# EAGLE design esptoy_v123 (EAGLE 7.2.0)
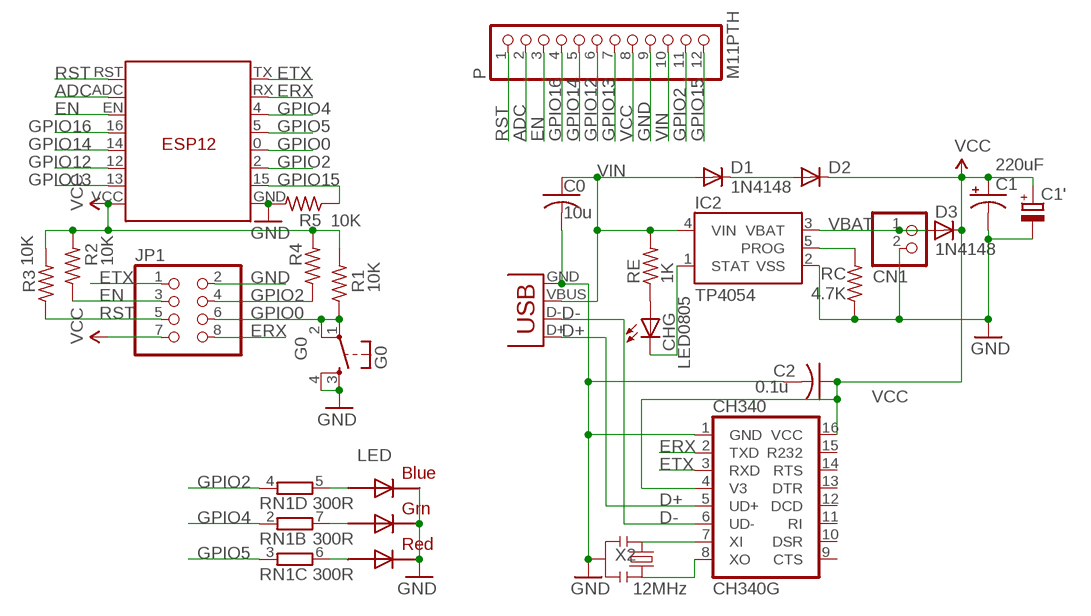
[diagram p0: schematic, sheet 1]

## Parts
C0  10u  C-USC0805K  [C0805K]
C1  220uF  CAP_POL3528-KIT  [EIA3528-KIT]
C1'  CPOL-EUD  [PANASONIC_D]
C2  0.1u  C-USC0603K  [C0603K]
CH340  CH340G  [SO16]
CHG  LED0805  LEDCHIPLED_0805  [CHIPLED_0805]
CN1  JST_2PIN-SMT-RA  [JST-PH-2-SMT-RA]
D1  1N4148  DIODE-MINIMELF  [MINIMELF]
D2  DIODE-MINIMELF  [MINIMELF]
D3  1N4148  DIODE-MINIMELF  [MINIMELF]
G0  G0  TAC_SWITCHSMD  [TACTILE_SWITCH_SMD]
IC2  TP4054  MCP73831  [SOT23-5]
JP1  PINHD-2X4  [2X04]
LED  RGBLED5050  [RGBLED5050]
P  M11PTH  PINHD-1X12-CB  [1X12-CB]
R1  10K  R-US_R0603  [R0603]
R2  10K  R-US_R0603  [R0603]
R3  10K  R-US_R0603  [R0603]
R4  R-US_R0603  [R0603]
R5  10K  R-US_R0603  [R0603]
RC  4.7K  R-US_R0805  [R0805]
RE  1K  R-US_R0603  [R0603]
RN1  300R  4R-NEXB38V  [EXB38V]
U$1  ESP12  [ESP12]
X2  12MHz  RESONATORSMD  [RESONATOR-SMD]
X3  USB-MICROB  [USB-MICROB]

## Nets
ADC: P.2 U$1.ADC
D+: CH340.5(UD+) X3.D+
D-: CH340.6(UD-) X3.D-
EN: JP1.3 P.3 R2.1 U$1.EN
ERX: CH340.2(TXD) JP1.8 U$1.RX
ETX: CH340.3(RXD) JP1.1 U$1.TX
GND: C0.2 C1'.- C1.C(-) C2.2 CH340.1(GND) CN1.2 G0.3 G0.4 IC2.2(VSS) JP1.2 LED.4(BLUE_C) LED.5(RED_C) LED.6(GREEN_C) P.9 R5.2 RC.1 U$1.GND X2.2 X3.GND
GPIO0: G0.1 G0.2 JP1.6 R1.1 U$1.0(G0)
GPIO2: JP1.4 P.11 R4.1 RN1.4 U$1.2(G2)
GPIO4: RN1.2 U$1.4(G4)
GPIO5: RN1.3 U$1.5(G5)
GPIO12: P.6 U$1.12(G12)
GPIO13: P.7 U$1.13(G13)
GPIO14: P.5 U$1.14(G14)
GPIO15: P.12 R5.1 U$1.15(G15)
GPIO16: P.4 U$1.16(G16)
N$1: D1.C D2.A
N$2: LED.3(BLUE_A) RN1.5
N$3: IC2.5(PROG) RC.2
N$4: CHG.A RE.1
N$5: CHG.C IC2.1(STAT)
N$6: LED.1(GREEN_A) RN1.7
N$7: LED.2(RED_A) RN1.6
N$11: CH340.7(XI) X2.1
N$13: CH340.8(XO) X2.3
RST: JP1.5 P.1 R3.1 U$1.RST
VBAT [power]: CN1.1 D3.A IC2.3(VBAT)
VCC [power]: C1'.+ C1.A(+) C2.1 CH340.4(V3) CH340.16(VCC) D2.C D3.C JP1.7 P.8 R1.2 R2.2 R3.2 R4.2 U$1.VCC
VIN [power]: C0.1 D1.A IC2.4(VIN) P.10 RE.2 X3.VBUS
Unconnected: CH340.9(CTS) CH340.10(DSR) CH340.11(RI) CH340.12(DCD) CH340.13(DTR) CH340.14(RTS) CH340.15(R232) RN1.1 RN1.8

## Library data of the parts
C0 = adafruit2013:C-US: CAPACITOR, American symbol
C1 = SparkFunNew:CAP_POL: Capacitor Polarized These are standard SMD and PTH capacitors. Normally 10uF, 47uF, and 100uF in electrolytic and tantalum varieties. Always verify the external diameter of the through hole cap, it varies with capacity, voltage, and manufacturer. The EIA devices should be standard.
C1' = rcl:CPOL-EU: POLARIZED CAPACITOR, European symbol
C2 = adafruit:C-US: CAPACITOR, American symbol
CH340 = SparkFunNew:CH340
CHG = led:LED: LED OSRAM: - CHIPLED LG R971, LG N971, LY N971, LG Q971, LY Q971, LO R971, LY R971 LH N974, LH R974 LS Q976, LO Q976, LY Q976 LO Q996 - Hyper CHIPLED LW Q18S LB Q993, LB Q99A, LB R99A - SideLED LS A670, LO A670, LY A670, LG A670, LP A670 LB A673, LV A673, LT A673, LW A673 LH A674 LY A675 LS A676, LA A676, LO A676, LY A676, LW A676 LS A679, LY A679, LG A679 - Hyper Micro SIDELED® LS Y876, LA Y876, LO Y876, LY Y876 LT Y87S - SmartLED LW L88C, LW L88S LB L89C, LB L89S, LG L890 LS L89K, LO L89K, LY L89K LS L896, LA L896, LO L896, LY L896 - TOPLED LS T670, LO T670, LY T670, LG T670, LP T670 LSG T670, LSP T670, LSY T670, LOP T670, LYG T670 LG T671, LOG T671, LSG T671 LB T673, LV T673, LT T673, LW T673 LH T674 LS T676, LA T676, LO T676, LY T676, LB T676, LH T676, LSB T676, LW T676 LB T67C, LV T67C, LT T67C, LS T67K, LO T67K, LY T67K, LW E67C LS E67B, LA E67B, LO E67B, LY E67B, LB E67C, LV E67C, LT E67C LW T67C LS T679, LY T679, LG T679 LS T770, LO T770, LY T770, LG T770, LP T770 LB T773, LV T773, LT T773, LW T773 LH T774 LS E675, LA E675, LY E675, LS T675 LS T776, LA T776, LO T776, LY T776, LB T776 LHGB T686 LT T68C, LB T68C - Hyper Mini TOPLED® LB M676 - Mini TOPLED Santana® LG M470 LS M47K, LO M47K, LY M47K Source: http://www.osram.convergy.de LUXEON: - LUMILED® LXK2-PW12-R00, LXK2-PW12-S00, LXK2-PW14-U00, LXK2-PW14-V00 LXK2-PM12-R00, LXK2-PM12-S00, LXK2-PM14-U00 LXK2-PE12-Q00, LXK2-PE12-R00, LXK2-PE12-S00, LXK2-PE14-T00, LXK2-PE14-U00 LXK2-PB12-K00, LXK2-PB12-L00, LXK2-PB12-M00, LXK2-PB14-N00, LXK2-PB14-P00, LXK2-PB14-Q00 LXK2-PR12-L00, LXK2-PR12-M00, LXK2-PR14-Q00, LXK2-PR14-R00 LXK2-PD12-Q00, LXK2-PD12-R00, LXK2-PD12-S00 LXK2-PH12-R00, LXK2-PH12-S00 LXK2-PL12-P00, LXK2-PL12-Q00, LXK2-PL12-R00 Source: www.luxeon.com KINGBRIGHT: KA-3528ASYC Source: www.kingbright.com
CN1 = adafruit:JST_2PIN: JST 2-Pin Connectors of various flavors SMT-RA (S2B-PH-SM4) 4UConnector #17311 SMT (B2B-PH-SM4) THM-RA (S2B-PH) THM (B2B-PH)
D1-D3 = diode:DIODE-: DIODE
G0 = SparkFunNew:TAC_SWITCH: Momentary Switch Button commonly used for reset or general input. Spark Fun Electronics SKU : COM-00097
IC2 = SparkFunNew:MCP73831: Microchip's MCP73831 Miniature single cell, fully integrated Li-Ion, Li-polymer charge management controller http://ww1.microchip.com/downloads/en/DeviceDoc/21984a.pdf
JP1 = pinhead:PINHD-2X4: PIN HEADER
LED = adafruit:RGBLED: For 5050 RGB LEDs, the order of the LEDs may vary from one manufacturer to another!
P = adafruit:PINHD-1X12: PIN HEADER
R1-R5 RE = adafruit (picker 的冲突副本 2014-10-29):R-US_: RESISTOR, American symbol
RC = adafruit2013:R-US_: RESISTOR, American symbol
RN1 = resistor-dil:4R-N: Array Chip Resistor Source: RS Component / Phycomp; OC_FARNELL: unknown; OC_NEWARK: unknown
U$1 = JeeParts:ESP12
X2 = SparkFunNew:RESONATOR: Resonator Small SMD resonator. This is the itty bitty 10/20MHz resonators with built in caps. CSTCE10M0G55 and CSTCE20M0V53. Footprint has been reviewed closely but hasn't been tested yet.
X3 = SparkFunNew:USB: USB Connectors USB-B-PTH is fully proven SKU : PRT-00139 USB-miniB is fully proven SKU : PRT-00587 USB-A-PCB is untested. USB-A-H is throughly reviewed, but untested. Spark Fun Electronics SKU : PRT-00437 USB-B-SMT is throughly reviewed, but untested. Needs silkscreen touching up. USB-A-S has not been used/tested USB-MB-H has not been used/tested

## Net classes
0 default: width 0.178 mm, clearance 0.178 mm
1 power: width 0.254 mm, clearance 0.178 mm

## Board
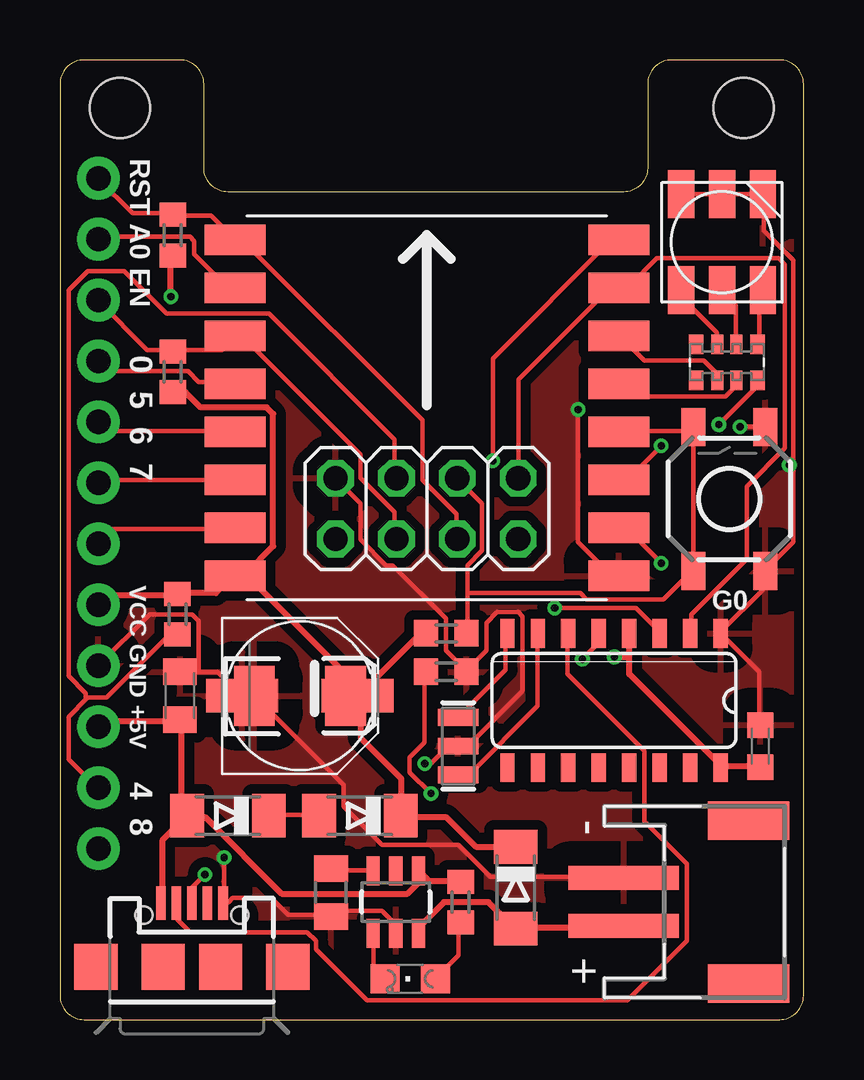
[diagram p1: board, top side]
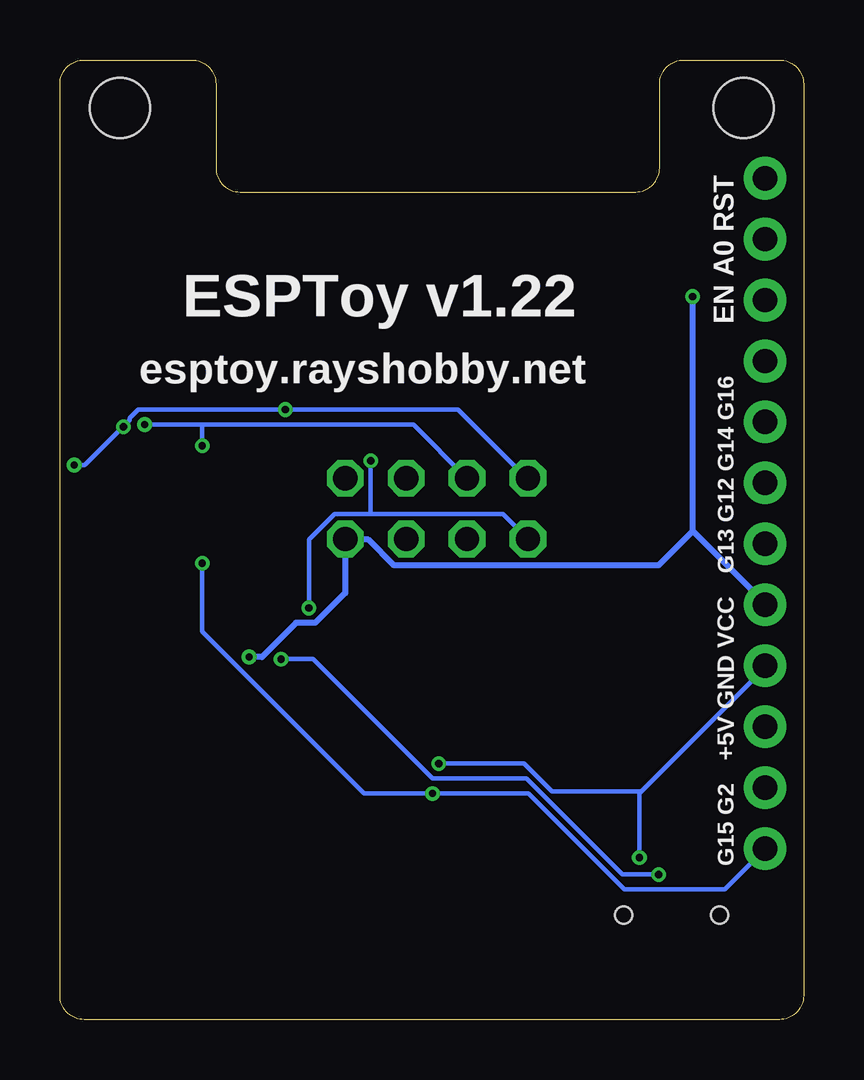
[diagram p2: board, bottom side, seen from below]

Size 31 x 40 mm. Coordinates in mm from the lower left corner, seen from the top.
Outline: 1,0 30,0 arc90 31,1 31,39 arc90 30,40 25.5,40 arc90 24.5,39 24.5,35.5 arc-90 23.5,34.5 7,34.5 arc-90 6,35.5 6,39 arc90 5,40 1,40 arc90 0,39 0,1 arc90 1,0
Copper layers (1*16): Top 0.035mm / dielectric 1.5mm / Bottom 0.035mm
Design rules "Fusion_eagle_rule_v1.1 *": minimum track width 6mil, minimum drill 12mil, track to track 6mil, track to pad 6mil, pad to pad 6mil, via to via 6mil, smd to smd 0mil, copper to edge 10mil, drill to drill 10mil, minimum pad ring 10mil, minimum via ring 6mil, stop-mask expansion 2mil, vias tented up to drill 100mil, thermal gap 40mil
Holes 2.5 mm at 28.5,38 2.5,38
tRestrict: area 26.7,36.2 to 30.3,39.8; area 0.7,36.2 to 4.3,39.8
vRestrict: area 2.9,6.2 to 3.9,35.8

### Footprints (pad centres in the part's own frame; a part is rotated, then mirrored left to right if it is on the bottom)
C0805K = smd 1.1 x 1.4: 1 -1,0; 2 1,0
EIA3528-KIT = smd 1.7 x 2.5: A 1.9,0; C -1.9,0
PANASONIC_D = smd 3 x 1.4: + 2.4,0; - -2.4,0
C0603K = smd 1.05 x 1.08: 1 -0.875,0; 2 0.875,0
SO16 = smd 0.6 x 1.2: 1 -4.445,-2.8; 2 -3.175,-2.8; 3 -1.905,-2.8; 4 -0.635,-2.8; 5 0.635,-2.8; 6 1.905,-2.8; 7 3.175,-2.8; 8 4.445,-2.8; 9 4.445,2.8; 10 3.175,2.8; 11 1.905,2.8; 12 0.635,2.8; 13 -0.635,2.8; 14 -1.905,2.8; 15 -3.175,2.8; 16 -4.445,2.8
CHIPLED_0805 = smd 1.2 x 1.2: A 0,-1.05; C 0,1.05
JST-PH-2-SMT-RA = smd 1 x 4.6: 1 1,-3.7; 2 -1,-3.7 | smd 1.6 x 3.4: NC1 -3.4,1.5; NC2 3.4,1.5
MINIMELF = smd 1.4 x 1.8: A 1.7,0; C -1.7,0
TACTILE_SWITCH_SMD = smd 1.6 x 1: 1 -3,1.5; 2 3,1.5; 3 -3,-1.5; 4 3,-1.5
SOT23-5 = smd 0.55 x 1.2: 1 -0.95,-1.3; 2 0,-1.3; 3 0.95,-1.3; 4 0.95,1.3; 5 -0.95,1.3; 6 0,1.3
2X04 = drill 1.016 octagon: 1 -3.81,-1.27; 2 -3.81,1.27; 3 -1.27,-1.27; 4 -1.27,1.27; 5 1.27,-1.27; 6 1.27,1.27; 7 3.81,-1.27; 8 3.81,1.27
RGBLED5050 = smd 2 x 1.1: 1 -2,1.7; 2 -2,0; 3 -2,-1.7; 4 2,-1.7; 5 2,0; 6 2,1.7
1X12-CB = drill 1.016 pad 1.778: 1 -13.97,0; 2 -11.43,0; 3 -8.89,0; 4 -6.35,0; 5 -3.81,0; 6 -1.27,0; 7 1.27,0; 8 3.81,0; 9 6.35,0; 10 8.89,0; 11 11.43,0; 12 13.97,0
R0603 = smd 1 x 1.1: 1 -0.85,0; 2 0.85,0
R0805 = smd 1.1 x 1.4: 1 -1,0; 2 1,0
EXB38V = smd 0.6 x 0.8: 1 -1.275,-0.75; 4 1.275,-0.75; 5 1.275,0.75; 8 -1.275,0.75 | smd 0.5 x 0.8: 2 -0.4,-0.75; 3 0.4,-0.75; 6 0.4,0.75; 7 -0.4,0.75
ESP12 = smd 2.54 x 1.27: 0 8,-2; 2 8,-4; 4 8,2; 5 8,0; 12 -8,-4; 13 -8,-6; 14 -8,-2; 15 8,-6; 16 -8,0; ADC -8,4; EN -8,2; GND 8,-8; RST -8,6; RX 8,4; TX 8,6; VCC -8,-8
RESONATOR-SMD = smd 0.7 x 1.7: 1 -1.2,0; 2 0,0; 3 1.2,0
USB-MICROB = smd 0.4 x 1.4: D+ 0,2.65; D- -0.65,2.65; GND 1.3,2.65; ID 0.65,2.65; VBUS -1.3,2.65 | smd 1.8 x 1.9: MT1 -4,0; MT2 4,0; MT3 1.2,0; MT4 -1.2,0 | hole 0.7: -2,2.15; 2,2.15

### Placement (x,y rotation side)
C0  5,13.5 90 top
C1  10,13.5 0 top
C1'  10,13.5 0 top
C2  29.2,11.4 90 top
CH340  23.1,13.3 180 top
CHG  14.6,1.7 90 top
CN1  27.2,4.9 270 top
D1  7,8.5 180 top
D2  12.5,8.5 180 top
D3  19,5.5 270 top
G0  27.9,21.7 90 top
IC2  14,4.9 0 top
JP1  15.3,21.3 0 top
LED  27.6,32.4 90 top
P  1.6,21.1 270 top
R1  16.1,16.1 180 top
R2  4.7,27 270 top
R3  4.7,32.7 270 top
R4  4.9,16.9 90 top
R5  16.1,14.5 0 top
RC  11.3,5.3 90 top
RE  16.7,4.9 90 top
RN1  27.8,27.4 0 top
U$1  15.3,26.5 0 top
X2  16.6,11.4 90 top
X3  5.5,2.2 0 top

### Tracks (layer width: path | path; a pad name or v marks a point on that pad's centre or on a via)
ADC
  Top 0.178: U$1.ADC 7.29,30.58 6.93,30.58 5.6,31.91 5.6,32.45 5.42,32.63 1.69,32.63 P.2
D+  (via drill 0.3)
  Top 0.178: v21.78,15.02 22.4,15.65 22.4,16.09 CH340.5 | v6.04,6.04 5.51,5.51 5.51,4.89 X3.D+
  Bottom 0.178: v21.78,15.02 20.45,15.02 15.47,10.05 11.56,10.05 7.56,6.04 v6.04,6.04
D-
  Top 0.178: CH340.6 21.16,16.09 21.16,14.4 24.36,11.2 24.36,8.27 26.14,6.49 26.14,3.29 23.65,0.8 12.8,0.8 10.67,2.93 10.67,3.29 10.31,3.65 5.42,3.65 4.89,4.18 4.89,4.8 X3.D-
EN
  Top 0.178: P.3 1.6,29.96 3.65,27.91 4.62,27.91 R2.1 4.71,27.91 6.76,27.91 7.29,28.45 U$1.EN 7.38,28.45 7.64,28.45 12.54,23.56 12.54,22.58 13.96,21.16 13.96,20.09 JP1.3
ERX
  Top 0.178: CH340.2 26.31,16.18 26.31,16.89 28.63,19.2 28.63,22.23 30.23,23.82 30.23,31.47 29.96,31.74 24.89,31.74 23.74,30.58 23.38,30.58 U$1.RX 22.94,30.49 19.11,26.67 JP1.8
ETX  (via drill 0.3)
  Top 0.178: v20.62,17.16 24,17.16 24.98,16.18 CH340.3 | v18.05,23.29 18.05,27.56 22.94,32.45 23.29,32.45 U$1.TX
  Bottom 0.178: v20.62,17.16 20.62,20 19.56,21.07 18.05,21.07 | 18.05,21.07 12.54,21.07 11.56,20.09 JP1.1 | 18.05,21.07 v18.05,23.29
GND  (via drill 0.3)
  Top 0.178: IC2.2 13.96,3.65 13.96,4 13.42,4.53 11.56,4.53 11.38,4.36 RC.1 11.29,4.36 9.51,4.36 8.8,5.07 7.2,5.07 7.02,4.89 6.84,4.89 X3.GND 6.84,4.98 v6.84,6.76 | 5.78,14.49 6.58,14.49 7.56,13.51 C1'.- 7.64,13.51 8.09,13.51 C1.C 8.18,13.42 11.82,9.78 11.82,8.89 13.42,7.29 16.62,7.29 17.96,5.96 23.47,5.96 CN1.2 | 5.78,14.49 5.07,14.49 C0.2 | 5.78,14.49 5.78,16.62 5.51,16.89 3.73,16.89 P.9 | LED.6 25.96,34.4 27.56,34.4 LED.5 27.65,34.4 29.25,34.4 LED.4 29.34,34.31 29.34,32.89 30.58,31.65 30.58,23.11 | C2.2 29.16,12.36 29.16,14.49 CH340.1 27.56,16.18 29.34,17.96 29.34,18.67 G0.3 29.43,18.76 30.58,19.91 30.58,23.11 | 16.98,14.49 R5.2 | R5.2 16.89,14.58 16.09,15.38 16.09,16.71 13.87,18.94 13.6,18.94 12.54,20 12.54,21.51 11.56,22.49 JP1.2 | v28.36,24.71 29.34,24.71 G0.4 | R5.2 16.98,14.58 17.78,15.38 17.78,16.54 18.22,16.98 19.11,16.98 19.29,16.8 19.29,13.69 17.07,11.47 16.62,11.47 X2.2 16.54,11.38 16.18,11.38 15.47,10.67 v15.2,10.67 | v21.6,25.43 21.6,19.91 22.94,18.58 23.29,18.58 U$1.GND | v30.4,23.11 30.58,23.11
  Bottom 0.178: v6.84,6.76 6.84,9.42 6.8,9.47 | 6.8,9.47 1.6,14.67 P.9 | JP1.2 11.56,22.58 14.4,25.43 v21.6,25.43 27.74,25.43 28.09,25.07 28.09,24.98 v28.36,24.71 29.96,23.11 v30.4,23.11 | v15.2,10.67 11.65,10.67 10.49,9.51 6.84,9.51 6.8,9.47
  pour Top (isolate 0.406): 0,33 31,33 31,0 0,0
GPIO0
  Top 0.178: 16.98,17.78 16.98,18.94 17.6,19.56 17.6,21.51 16.62,22.49 JP1.6 | 16.98,17.78 16.98,16.18 R1.1 | 26.4,24.54 26.4,24.62 G0.2 26.4,24.54 | 26.4,24.54 26.4,18.76 G0.1 26.31,18.67 25.16,17.51 21.96,17.51 21.69,17.78 16.98,17.78 | 26.4,24.54 23.38,24.54 U$1.0
GPIO2  (via drill 0.3)
  Top 0.178: 1.11,13.38 0.36,12.62 0.36,10.85 1.51,9.69 P.11 | 1.11,13.38 1.16,13.42 1.96,13.42 4.53,16 4.89,16 R4.1 | v27.47,24.8 29.07,26.4 29.07,26.58 RN1.4 | v25.07,23.91 23.74,22.58 23.38,22.58 U$1.2 | 1.11,13.38 1.07,13.42 1.07,13.6 0.36,14.31 0.36,30.4 1.16,31.2 2.67,31.2 4.45,29.43 8.71,29.43 13.96,24.18 13.96,22.58 JP1.4
  Bottom 0.178: 25.07,24.8 16.27,24.8 14.05,22.58 JP1.4 | 25.07,24.8 v27.47,24.8 | 25.07,24.8 v25.07,23.91
GPIO4
  Top 0.178: RN1.2 27.38,26.67 27.38,26.94 26.85,27.47 24.36,27.47 23.38,28.45 U$1.4
GPIO5
  Top 0.178: RN1.3 28.18,26.58 28.18,26.4 27.74,25.96 23.91,25.96 23.38,26.49 U$1.5
GPIO12
  Top 0.178: U$1.12 1.69,22.49 1.6,22.4 P.6
GPIO13
  Top 0.178: U$1.13 7.29,20.45 2.13,20.45 1.6,19.91 P.7
GPIO14
  Top 0.178: U$1.14 7.29,24.54 1.96,24.54 1.6,24.89 P.5
GPIO15  (via drill 0.3)
  Top 0.178: v15.47,9.42 14.58,10.31 14.58,10.94 15.2,11.56 15.2,14.49 R5.1 | v25.07,19.02 23.65,20.45 23.38,20.45 U$1.15
  Bottom 0.178: P.12 1.6,7.11 3.29,5.42 7.47,5.42 11.47,9.42 v15.47,9.42 18.31,9.42 25.07,16.18 v25.07,19.02
GPIO16
  Top 0.178: U$1.16 7.29,26.58 5.78,26.58 5.33,27.03 1.96,27.03 1.6,27.38 P.4
N$1
  Top 0.178: D1.C 8.71,8.53 10.76,8.53 D2.A
N$2
  Top 0.178: RN1.5 29.16,28.18 29.16,30.23 29.25,30.32 LED.3
N$3
  Top 0.178: IC2.5 12.98,6.22 11.38,6.22 RC.2
N$4
  Top 0.178: RE.1 16.62,4 16.62,2.67 15.73,1.78 CHG.A
N$5
  Top 0.178: IC2.1 13.07,3.56 13.07,2.22 13.51,1.78 CHG.C
N$6
  Top 0.178: RN1.7 27.38,28.18 27.38,28.63 25.96,30.05 25.96,30.32 LED.1
N$7
  Top 0.178: RN1.6 28.18,28.18 28.18,29.78 27.65,30.32 LED.2
N$11
  Top 0.178: CH340.7 19.91,16.09 19.91,13.07 17.07,10.22 16.62,10.22 X2.1
N$13
  Top 0.178: CH340.8 18.58,16.09 18.58,14.58 16.62,12.62 X2.3
RST
  Top 0.178: P.1 1.6,35.03 3.02,33.6 4.62,33.6 R3.1 4.71,33.52 6.31,33.52 7.29,32.54 U$1.RST 7.38,32.45 7.64,32.45 15.11,24.98 15.11,22.49 16.54,21.07 16.54,20.09 JP1.5
VBAT
  Top 0.254: IC2.3 15.02,3.65 15.02,3.91 16,4.89 17.87,4.89 18.94,3.82 D3.A 19.11,3.82 23.47,3.82 CN1.1
VCC  (via drill 0.3)
  Top 0.254: D3.C 18.94,7.2 17.34,7.2 16.09,8.45 14.22,8.45 D2.C 14.22,8.62 14.22,10.05 12.54,11.73 12.54,13.42 C1.A | R1.2 15.2,16.09 15.02,16.09 12.45,13.51 C1'.+ 12.27,13.51 11.91,13.51 C1.A | R2.2 4.71,26.14 5.25,26.14 5.87,25.51 8.62,25.51 8.89,25.25 8.89,19.74 7.73,18.58 7.38,18.58 U$1.VCC | U$1.VCC 7.2,18.49 6.49,17.78 4.98,17.78 R4.2 4.8,17.69 1.96,17.69 1.6,17.34 P.8 | C2.1 29.16,10.58 27.56,10.58 CH340.16 27.47,10.67 23.74,14.4 23.74,15.11 | 23.74,15.11 CH340.4 | v4.62,30.14 4.62,31.83 R3.2 | v23.11,15.11 23.74,15.11 | C1.A 11.82,13.6 11.82,14.49 7.82,18.49 U$1.VCC
  Bottom 0.254: 4.62,20.36 v4.62,30.14 | 4.62,20.36 1.6,17.34 P.8 | 4.62,20.36 6.04,18.94 17.07,18.94 18.14,20 19.02,20 JP1.7 19.11,19.91 19.11,17.78 20.36,16.54 21.16,16.54 22.58,15.11 v23.11,15.11
VIN
  Top 0.254: P.10 1.6,12.27 1.78,12.45 4.98,12.45 C0.1 5.07,12.36 5.07,8.8 5.25,8.62 D1.A | RE.2 16.62,5.78 15.38,5.78 15.02,6.13 IC2.4 15.11,5.87 14.49,5.25 9.25,5.25 6.04,8.45 5.42,8.45 D1.A | X3.VBUS 4.27,4.89 4.27,7.47 5.25,8.45 D1.A

### Text on the board
tPlace: RST A0 EN | 0 5 6 7 | VCC GND +5V | 4 8
bPlace: EN A0 RST | G13 G12 G14 G16 | +5V GND VCC | G15 G2
bNames: ESPToy v1.22 | esptoy.rayshobby.net